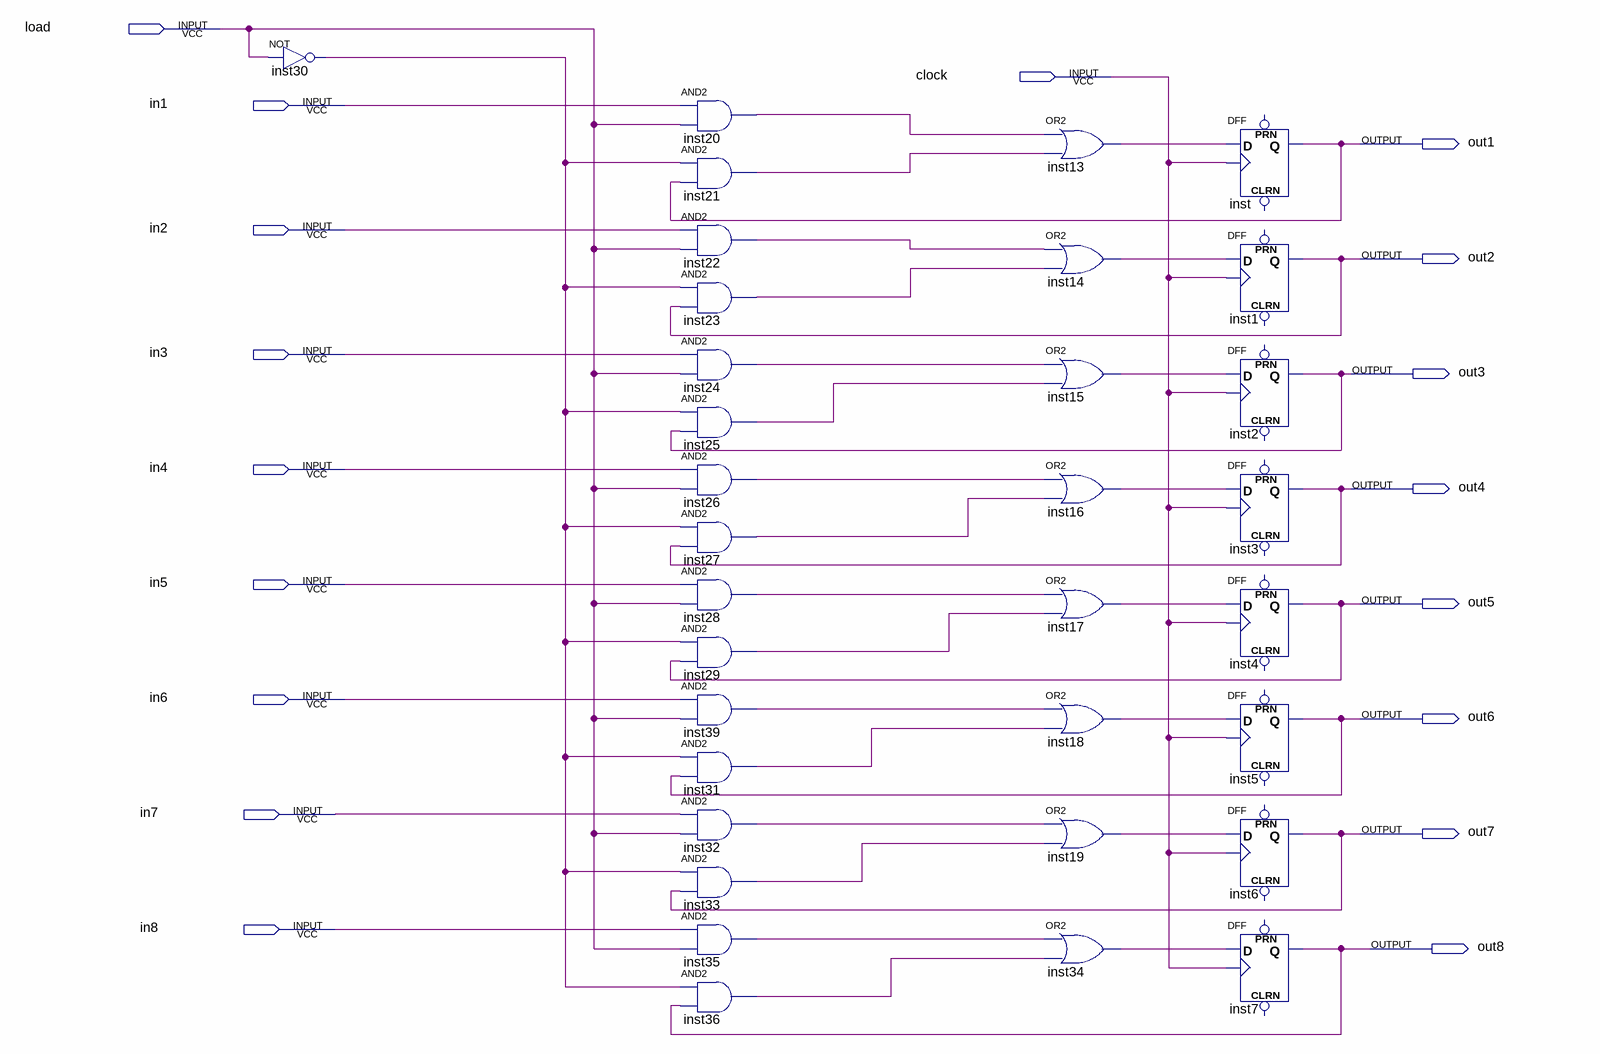
[diagram p0: schematic sheet]
// Quartus schematic lab3.bdf as structural Verilog: 33 symbols, 18 pins
module lab3 (
  input  load,
  input  clock,
  input  in1,
  input  in2,
  input  in3,
  input  in4,
  input  in5,
  input  in6,
  input  in7,
  input  in8,
  output out1,
  output out2,
  output out3,
  output out4,
  output out5,
  output out6,
  output out7,
  output out8
);

  wire inst13_out, inst14_out, inst15_out, inst16_out, inst17_out, inst18_out, inst19_out, inst20_out,
       inst21_out, inst22_out, inst23_out, inst24_out, inst25_out, inst26_out, inst27_out, inst28_out,
       inst29_out, inst30_out, inst31_out, inst32_out, inst33_out, inst34_out, inst35_out, inst36_out,
       inst39_out;

  not inst30 (inst30_out, load);
  and inst20 (inst20_out, in1, load);
  and inst21 (inst21_out, inst30_out, out1);
  and inst22 (inst22_out, in2, load);
  and inst23 (inst23_out, inst30_out, out2);
  and inst24 (inst24_out, in3, load);
  and inst25 (inst25_out, inst30_out, out3);
  and inst26 (inst26_out, in4, load);
  and inst27 (inst27_out, inst30_out, out4);
  and inst28 (inst28_out, in5, load);
  and inst29 (inst29_out, inst30_out, out5);
  and inst39 (inst39_out, in6, load);
  and inst31 (inst31_out, inst30_out, out6);
  and inst32 (inst32_out, in7, load);
  and inst33 (inst33_out, inst30_out, out7);
  and inst35 (inst35_out, in8, load);
  and inst36 (inst36_out, inst30_out, out8);
  or inst13 (inst13_out, inst20_out, inst21_out);
  or inst14 (inst14_out, inst22_out, inst23_out);
  or inst15 (inst15_out, inst24_out, inst25_out);
  or inst16 (inst16_out, inst26_out, inst27_out);
  or inst17 (inst17_out, inst28_out, inst29_out);
  or inst18 (inst18_out, inst39_out, inst31_out);
  or inst19 (inst19_out, inst32_out, inst33_out);
  or inst34 (inst34_out, inst35_out, inst36_out);
  DFF inst (.CLK(clock), .D(inst13_out), .Q(out1));  // open: CLRN, PRN
  DFF inst1 (.CLK(clock), .D(inst14_out), .Q(out2));  // open: CLRN, PRN
  DFF inst2 (.CLK(clock), .D(inst15_out), .Q(out3));  // open: CLRN, PRN
  DFF inst3 (.CLK(clock), .D(inst16_out), .Q(out4));  // open: CLRN, PRN
  DFF inst4 (.CLK(clock), .D(inst17_out), .Q(out5));  // open: CLRN, PRN
  DFF inst5 (.CLK(clock), .D(inst18_out), .Q(out6));  // open: CLRN, PRN
  DFF inst6 (.CLK(clock), .D(inst19_out), .Q(out7));  // open: CLRN, PRN
  DFF inst7 (.CLK(clock), .D(inst34_out), .Q(out8));  // open: CLRN, PRN
endmodule
